# Altium project SVPXGR740_3U.PrjPcb (part 5 of 8)

## Sheet Flash.SchDoc
size A4
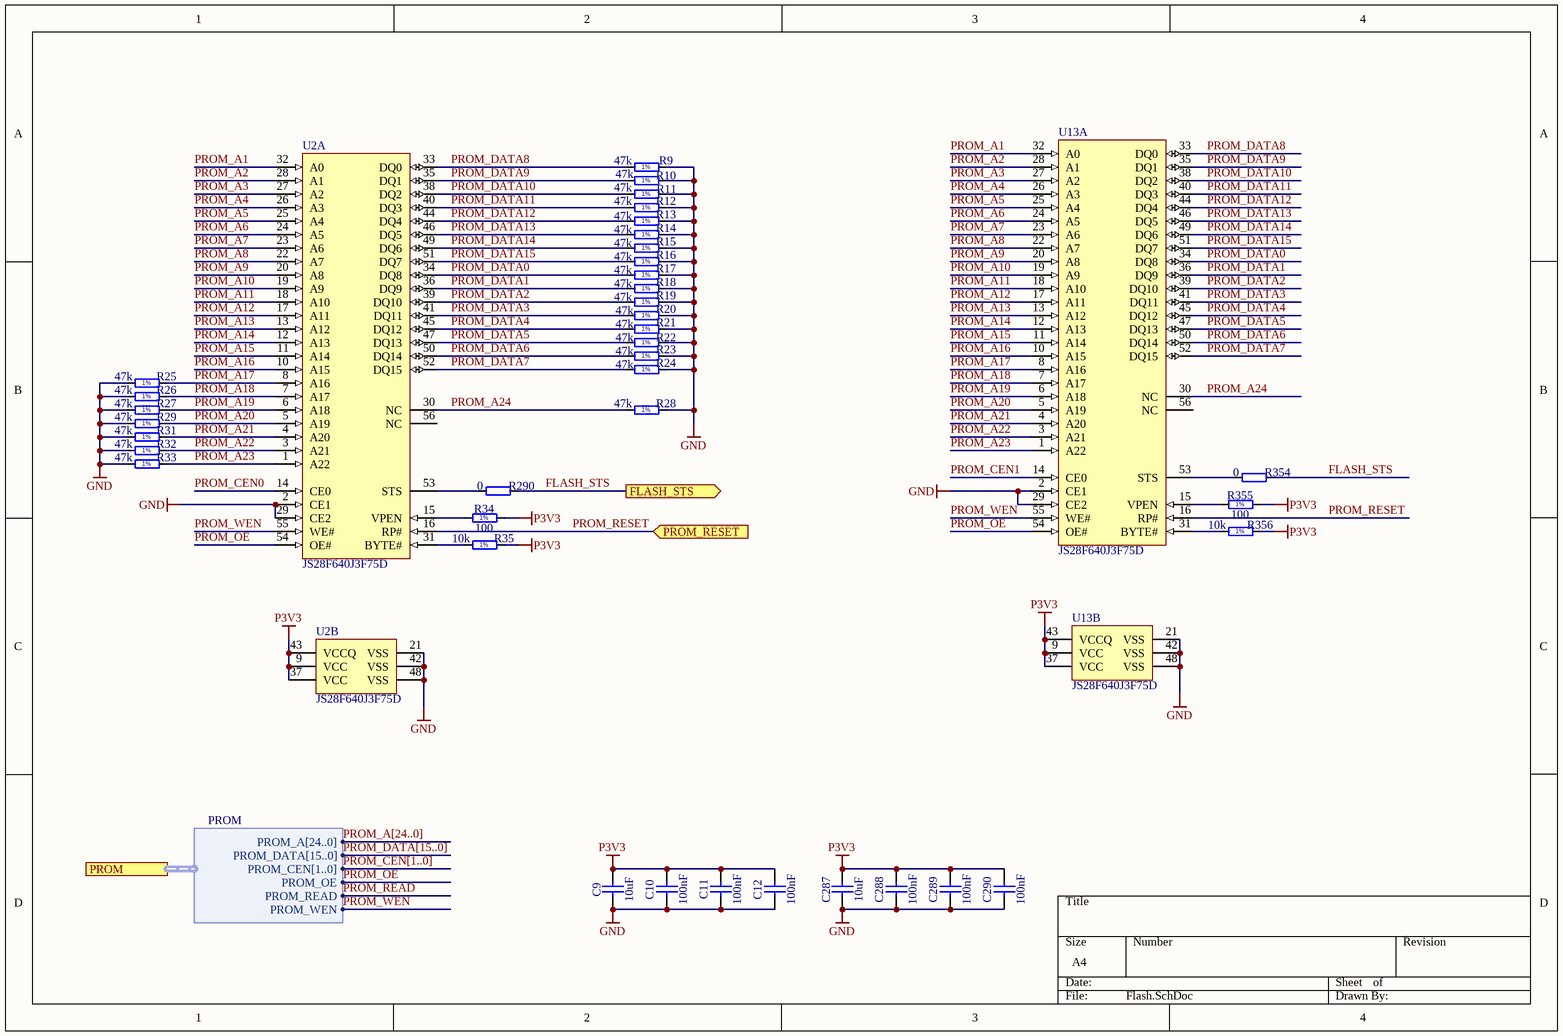
[diagram p13: Flash.SchDoc]

### Parts
C9  10uF  [CAPC2012X135N]
C10  100nF  [CAPC0603X33N]
C11  100nF  [CAPC0603X33N]
C12  100nF  [CAPC0603X33N]
C287  10uF  [CAPC2012X135N]
C288  100nF  [CAPC0603X33N]
C289  100nF  [CAPC0603X33N]
C290  100nF  [CAPC0603X33N]
R9  47k  [RESC1005X40N]
R10  47k  [RESC1005X40N]
R11  47k  [RESC1005X40N]
R12  47k  [RESC1005X40N]
R13  47k  [RESC1005X40N]
R14  47k  [RESC1005X40N]
R15  47k  [RESC1005X40N]
R16  47k  [RESC1005X40N]
R17  47k  [RESC1005X40N]
R18  47k  [RESC1005X40N]
R19  47k  [RESC1005X40N]
R20  47k  [RESC1005X40N]
R21  47k  [RESC1005X40N]
R22  47k  [RESC1005X40N]
R23  47k  [RESC1005X40N]
R24  47k  [RESC1005X40N]
R25  47k  [RESC1005X40N]
R26  47k  [RESC1005X40N]
R27  47k  [RESC1005X40N]
R28  47k  [RESC1005X40N]
R29  47k  [RESC1005X40N]
R31  47k  [RESC1005X40N]
R32  47k  [RESC1005X40N]
R33  47k  [RESC1005X40N]
R34  100  [RESC1005X40N]
R35  10k  [RESC1005X40N]
R290  0  [RESC0603X28N]
R354  0  [RESC0603X28N]
R355  100  [RESC1005X40N]
R356  10k  [RESC1005X40N]
U2  JS28F640J3F75D  [MICT-JS-56_N]  (parts A,B of 2)
U13  JS28F640J3F75D  [MICT-JS-56_N]  (parts A,B of 2)

### Ports
FLASH_STS (out), PROM (harness PROM), PROM_RESET (in)

### Harnesses
PROM: PROM_A[24..0], PROM_DATA[15..0], PROM_CEN[1..0], PROM_OE, PROM_READ, PROM_WEN

### Nets
GND: C9.1 C10.2 C11.2 C12.2 C287.1 C288.2 C289.2 C290.2 R9.2 R10.2 R11.2 R12.2 R13.2 R14.2 R15.2 R16.2 R17.2 R18.2 R19.2 R20.2 R21.2 R22.2 R23.2 R24.2 R25.1 R26.1 R27.1 R28.2 R29.1 R31.1 R32.1 R33.1 U2.2(CE1) U2.21(VSS) U2.29(CE2) U2.42(VSS) U2.48(VSS) U13.2(CE1) U13.21(VSS) U13.29(CE2) U13.42(VSS) U13.48(VSS)
P3V3: C9.2 C10.1 C11.1 C12.1 C287.2 C288.1 C289.1 C290.1 R34.2 R35.2 R355.2 R356.2 U2.9(VCC) U2.37(VCC) U2.43(VCCQ) U13.9(VCC) U13.37(VCC) U13.43(VCCQ)  [project net 3.3V]
FLASH_STS: R290.2 R354.2 ; port FLASH_STS
PROM_A1: U2.32(A0) U13.32(A0)
PROM_A2: U2.28(A1) U13.28(A1)
PROM_A3: U2.27(A2) U13.27(A2)
PROM_A4: U2.26(A3) U13.26(A3)
PROM_A5: U2.25(A4) U13.25(A4)
PROM_A6: U2.24(A5) U13.24(A5)
PROM_A7: U2.23(A6) U13.23(A6)
PROM_A8: U2.22(A7) U13.22(A7)
PROM_A9: U2.20(A8) U13.20(A8)
PROM_A10: U2.19(A9) U13.19(A9)
PROM_A11: U2.18(A10) U13.18(A10)
PROM_A12: U2.17(A11) U13.17(A11)
PROM_A13: U2.13(A12) U13.13(A12)
PROM_A14: U2.12(A13) U13.12(A13)
PROM_A15: U2.11(A14) U13.11(A14)
PROM_A16: U2.10(A15) U13.10(A15)
PROM_A17: R25.2 U2.8(A16) U13.8(A16)
PROM_A18: R26.2 U2.7(A17) U13.7(A17)
PROM_A19: R27.2 U2.6(A18) U13.6(A18)
PROM_A20: R29.2 U2.5(A19) U13.5(A19)
PROM_A21: R31.2 U2.4(A20) U13.4(A20)
PROM_A22: R32.2 U2.3(A21) U13.3(A21)
PROM_A23: R33.2 U2.1(A22) U13.1(A22)
PROM_A24: R28.1 U2.30(NC) U13.30(NC)
PROM_CEN0: U2.14(CE0)
PROM_CEN1: U13.14(CE0)
PROM_DATA0: R17.1 U2.34(DQ8) U13.34(DQ8)
PROM_DATA1: R18.1 U2.36(DQ9) U13.36(DQ9)
PROM_DATA2: R19.1 U2.39(DQ10) U13.39(DQ10)
PROM_DATA3: R20.1 U2.41(DQ11) U13.41(DQ11)
PROM_DATA4: R21.1 U2.45(DQ12) U13.45(DQ12)
PROM_DATA5: R22.1 U2.47(DQ13) U13.47(DQ13)
PROM_DATA6: R23.1 U2.50(DQ14) U13.50(DQ14)
PROM_DATA7: R24.1 U2.52(DQ15) U13.52(DQ15)
PROM_DATA8: R9.1 U2.33(DQ0) U13.33(DQ0)
PROM_DATA9: R10.1 U2.35(DQ1) U13.35(DQ1)
PROM_DATA10: R11.1 U2.38(DQ2) U13.38(DQ2)
PROM_DATA11: R12.1 U2.40(DQ3) U13.40(DQ3)
PROM_DATA12: R13.1 U2.44(DQ4) U13.44(DQ4)
PROM_DATA13: R14.1 U2.46(DQ5) U13.46(DQ5)
PROM_DATA14: R15.1 U2.49(DQ6) U13.49(DQ6)
PROM_DATA15: R16.1 U2.51(DQ7) U13.51(DQ7)
PROM_OE: U2.54(OE#) U13.54(OE#) ; port PROM.PROM_OE
PROM_RESET: U2.16(RP#) U13.16(RP#) ; port PROM_RESET
PROM_WEN: U2.55(WE#) U13.55(WE#) ; port PROM.PROM_WEN
NetR34_1: R34.1 U2.15(VPEN)
NetR35_1: R35.1 U2.31(BYTE#)
NetR290_1: R290.1 U2.53(STS)
NetR354_1: R354.1 U13.53(STS)
NetR355_1: R355.1 U13.15(VPEN)
NetR356_1: R356.1 U13.31(BYTE#)

Not connected (* = marked no-connect by the designer): U2 56(NC); U13 56(NC)

### Buses and harness runs
bus PROM_A[24..0]
bus PROM_CEN[1..0]
bus PROM_DATA[15..0]

### Notes on the sheet
- (in symbol R0402_10K_1%_0.0625W_100PPM) 1%
- (in symbol R0402_47K_1%_0.0625W_100PPM) 1%
- (in symbol R0402_100R_1%_0.0625W_100PPM) 1%

### Library data of the parts
C9 C287 = CC0805_10UF_16V_10%_X5R: Non-polarised capacitor; Part Description: SMD Multilayer Chip Ceramic Capacitor; Manufacturer: GENERIC; Manufacturer1 Part Number: C0805C106K4PAC; Voltage: 16V; TC: X5R; Tolerance: ±10%; Part Number: CC0805_10UF_16V_10%_X5R; Component Kind: Standard; Component Type: Standard; Pin Count: 2; Value: 10uF; Status: Preferred; Manufacturer Part Number: CC0805_10UF_16V_10%_X5R; Case: 0805; Mounted: Yes; Socket: No; SMD: Yes; Sense: No; Manufacturer1 Example: KEMET; Manufacturer1 ComponentHeight: 1.4mm; HelpURL: \\cern.ch\dfs\Applications\Altium\Datasheets\CC1206_X5R_KEMET.pdf; Author: CERN DEM JLC; CreateDate: 03.12.2007; LatestRevisionDate: 03.12.2007
C10-C12 C288-C290 = CC0201_100NF_6.3V_10%_X5R: Non-polarised capacitor; Manufacturer: GENERIC; Part Description: SMD Multilayer Chip Ceramic Capacitor; Manufacturer1 Part Number: 02016D104KAT2A; Voltage: 6.3V; TC: X5R; Tolerance: ±10%; Part Number: CC0201_100NF_6.3V_10%_X5R; Component Kind: Standard; Component Type: Standard; Pin Count: 2; Value: 100nF; Status: Not Recommended; Manufacturer Part Number: CC0201_100NF_6.3V_10%_X5R; Case: 0201; Mounted: Yes; Socket: No; SMD: Yes; Sense: No; Manufacturer1 Example: AVX; Manufacturer1 ComponentHeight: 0.33mm; HelpURL: \\cern.ch\dfs\Applications\Altium\Datasheets\CC0201_X5R_AVX.pdf; Author: CERN DEM JLC; CreateDate: 03/12/2007; LatestRevisionDate: 03/12/2007
R9-R29 R31-R33 = R0402_47K_1%_0.0625W_100PPM: Resistor - 1%; Part Description: General Purpose Thick Film Chip Resistor; Manufacturer: GENERIC; Manufacturer1 Part Number: 232270675103L; TC: ±100ppm/°C; PressFit: No; Part Number: R0402_47K_1%_0.0625W_100PPM; Component Kind: Standard; Component Type: Standard; Pin Count: 2; Value: 47k; Status: Not Recommended; Power: 0.0625W; Tolerance: ±1%; Manufacturer Part Number: R0402_47K_1%_0.0625W_100PPM; Case: 0402; Mounted: Yes; Sense: No; Socket: No; SMD: Yes; Manufacturer1 Example: YAGEO PHYCOMP; Manufacturer1 ComponentHeight: 0.4mm; HelpURL: \\cern.ch\dfs\Applications\Altium\Datasheets\R0402_Phycomp_RC0402.pdf; Author: CERN DEM JLC; CreateDate: 03.12.2007; LatestRevisionDate: 17.10.2012
R34 R355 = R0402_100R_1%_0.0625W_100PPM: Resistor - 1%; Part Description: General Purpose Thick Film Chip Resistor; Manufacturer: GENERIC; Manufacturer1 Part Number: 232270671001L; TC: ±100ppm/°C; PressFit: No; Part Number: R0402_100R_1%_0.0625W_100PPM; Component Kind: Standard; Component Type: Standard; Pin Count: 2; Value: 100; Status: Not Recommended; Power: 0.0625W; Tolerance: ±1%; Manufacturer Part Number: R0402_100R_1%_0.0625W_100PPM; Case: 0402; Mounted: Yes; Sense: No; Socket: No; SMD: Yes; Manufacturer1 Example: YAGEO PHYCOMP; Manufacturer1 ComponentHeight: 0.4mm; HelpURL: \\cern.ch\dfs\Applications\Altium\Datasheets\R0402_Phycomp_RC0402.pdf; Author: CERN DEM JLC; CreateDate: 03.12.2007; LatestRevisionDate: 17.10.2012
R35 R356 = R0402_10K_1%_0.0625W_100PPM: Resistor - 1%; Manufacturer: GENERIC; Part Description: General Purpose Thick Film Chip Resistor; Manufacturer1 Part Number: 232270671003L; TC: ±100ppm/°C; PressFit: No; Manufacturer Part Number: R0402_10K_1%_0.0625W_100PPM; Part Number: R0402_10K_1%_0.0625W_100PPM; Tolerance: ±1%; Value: 10k; Component Kind: Standard; Component Type: Standard; Pin Count: 2; Status: Not Recommended; Power: 0.0625W; Case: 0402; Mounted: Yes; Sense: No; Socket: No; SMD: Yes; Manufacturer1 Example: YAGEO PHYCOMP; Manufacturer1 ComponentHeight: 0.4mm; HelpURL: \\cern.ch\dfs\Applications\Altium\Datasheets\R0402_Phycomp_RC0402.pdf; Author: CERN DEM JLC; CreateDate: 03/12/2007; LatestRevisionDate: 17/10/2012
R290 R354 = R0201_0R_JUMPER: Resistor; Part Description: 1A (0.05R Max DC Resistance) Zero Ohm Jumper; Manufacturer: GENERIC; Manufacturer1 Part Number: CRCW02010000Z0ED; PressFit: No; Part Number: R0201_0R_JUMPER; Component Kind: Standard; Component Type: Standard; Pin Count: 2; Value: 0; Status: Not Recommended; Manufacturer Part Number: R0201_0R_JUMPER; Case: 0201; Mounted: Yes; Sense: No; Socket: No; SMD: Yes; Manufacturer1 Example: VISHAY; Manufacturer1 ComponentHeight: 0.27mm; HelpURL: \\cern.ch\dfs\Applications\Altium\Datasheets\R0201_VISHAY_CRCW e3.pdf; Author: CERN DEM JLC; CreateDate: 19.11.2014; LatestRevisionDate: 08.01.2015
U2 U13 = CMP-0358-00064-1: 64 Mb (x8/x16) Parallel NOR Flash Memory, 75 ns, 2.7 to 3.6 V, 56-pin TSOP (JS), Tape & Reel; Part Family: J3Â; Manufacturer: Micron; Voltage: 2.7V-3.6VÂ; Speed: 75nsÂ; Density: 64MbÂ; Op Temp: -40C to +85CÂ; ComponentLink3Description: Package Specification; PackageVersion: Rev. 12; ComponentLink1URL: http://www.micron.com/; DatasheetVersion: Rev. 03; ComponentLink3URL: http://www.micron.com/~/media/Documents/Products/Data%20Sheet/NOR%20Flash/Parallel/P33/320003_P33_65nm_MLC_256MDiscrete_512MStack_DS.pdf; Width: x8/x16Â; RoHS: YesÂ; PackageDescription: 56-Pin TSOP, 18.4 X 14 mm, Pitch 0.5 mm; ComponentLink2Description: Datasheet; PartNumber: JS28F640J3F75D; PackageReference: MICT-JS-56Â; ComponentLink1Description: Manufacturer URL; ComponentLink2URL: http://www.micron.com/~/media/Documents/Products/Data%20Sheet/NOR%20Flash/Parallel/J3/208032_J3_65_SBC_DS.pdf; Mounting Technology: Surface Mount

## Sheet CON_MC_XMC_J11_64PIN.SchDoc
size A4
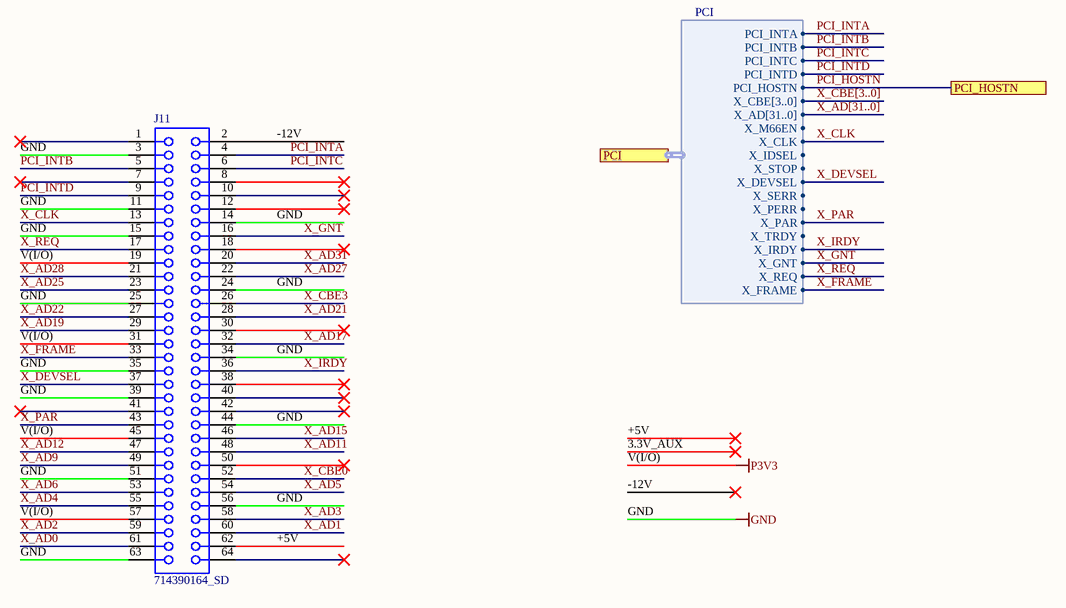
[diagram p14: CON_MC_XMC_J11_64PIN.SchDoc]

### Parts
J11  714390164_SD  [BTB1-2V64F]

### Ports
PCI (harness PCI), PCI_HOSTN

### Harnesses
PCI: PCI_INTA, PCI_INTB, PCI_INTC, PCI_INTD, PCI_HOSTN, X_CBE[3..0], X_AD[31..0], X_M66EN, X_CLK, X_IDSEL, X_STOP, X_DEVSEL, X_SERR, X_PERR, X_PAR, X_TRDY, X_IRDY, X_GNT, X_REQ, X_FRAME

### Nets
GND: J11.3 J11.11 J11.14 J11.15 J11.24 J11.25 J11.34 J11.35 J11.39 J11.44 J11.51 J11.56 J11.63
P3V3: J11.19 J11.31 J11.45 J11.57  [also labelled V(I/O)]  [project net 3.3V]
+5V: J11.62
-12V: J11.2
PCI_HOSTN: port PCI_HOSTN, port PCI.PCI_HOSTN
PCI_INTA: J11.4 ; port PCI.PCI_INTA
PCI_INTB: J11.5 ; port PCI.PCI_INTB
PCI_INTC: J11.6 ; port PCI.PCI_INTC
PCI_INTD: J11.9 ; port PCI.PCI_INTD
X_AD0: J11.61
X_AD1: J11.60
X_AD2: J11.59
X_AD3: J11.58
X_AD4: J11.55
X_AD5: J11.54
X_AD6: J11.53
X_AD9: J11.49
X_AD11: J11.48
X_AD12: J11.47
X_AD15: J11.46
X_AD17: J11.32
X_AD19: J11.29
X_AD21: J11.28
X_AD22: J11.27
X_AD25: J11.23
X_AD27: J11.22
X_AD28: J11.21
X_AD31: J11.20
X_CBE0: J11.52
X_CBE3: J11.26
X_CLK: J11.13 ; port PCI.X_CLK
X_DEVSEL: J11.37 ; port PCI.X_DEVSEL
X_FRAME: J11.33 ; port PCI.X_FRAME
X_GNT: J11.16 ; port PCI.X_GNT
X_IRDY: J11.36 ; port PCI.X_IRDY
X_PAR: J11.43 ; port PCI.X_PAR
X_REQ: J11.17 ; port PCI.X_REQ

Not connected (* = marked no-connect by the designer): J11 1* 7* 8* 10* 12* 18* 30* 38* 40* 41* 42* 50* 64*

### Buses and harness runs
bus X_AD[31..0]
bus X_CBE[3..0]

### Library data of the parts
J11 = CMP-0001-00081-1: Board-to-Board Connector, Vertical, 2-Row, Pitch 1mm, 64-Position, Female; Mating Connector: Molex-714360164; ClassName: Board Template Connector; Datasheet Version: Apr-2006; Package Reference: BTB1-2V64F; Publisher: Altium; Component Kind: Standard

## Sheet CON_MC_XMC_J12_64PIN.SchDoc
size A4
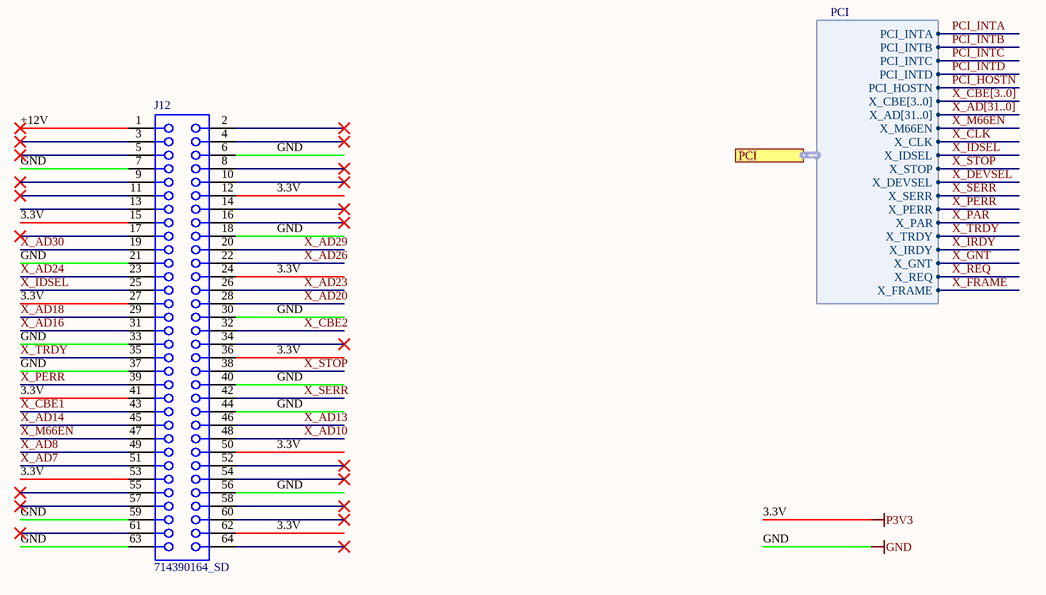
[diagram p15: CON_MC_XMC_J12_64PIN.SchDoc]

### Parts
J12  714390164_SD  [BTB1-2V64F]

### Ports
PCI (harness PCI)

### Harnesses
PCI: PCI_INTA, PCI_INTB, PCI_INTC, PCI_INTD, PCI_HOSTN, X_CBE[3..0], X_AD[31..0], X_M66EN, X_CLK, X_IDSEL, X_STOP, X_DEVSEL, X_SERR, X_PERR, X_PAR, X_TRDY, X_IRDY, X_GNT, X_REQ, X_FRAME

### Nets
3.3V: J12.12 J12.15 J12.24 J12.27 J12.36 J12.41 J12.50 J12.53 J12.62  [also labelled P3V3]
GND: J12.6 J12.7 J12.18 J12.21 J12.30 J12.33 J12.37 J12.40 J12.44 J12.56 J12.59 J12.63
+12V: J12.1
X_AD7: J12.51
X_AD8: J12.49
X_AD10: J12.48
X_AD13: J12.46
X_AD14: J12.45
X_AD16: J12.31
X_AD18: J12.29
X_AD20: J12.28
X_AD23: J12.26
X_AD24: J12.23
X_AD26: J12.22
X_AD29: J12.20
X_AD30: J12.19
X_CBE1: J12.43
X_CBE2: J12.32
X_IDSEL: J12.25 ; port PCI.X_IDSEL
X_M66EN: J12.47 ; port PCI.X_M66EN
X_PERR: J12.39 ; port PCI.X_PERR
X_SERR: J12.42 ; port PCI.X_SERR
X_STOP: J12.38 ; port PCI.X_STOP
X_TRDY: J12.35 ; port PCI.X_TRDY

Not connected (* = marked no-connect by the designer): J12 2* 3* 4* 5* 8* 9* 10* 11* 13 14* 16* 17* 34* 52* 54* 55* 57* 58* 60* 61* 64*

### Buses and harness runs
bus X_AD[31..0]
bus X_CBE[3..0]

### Library data of the parts
J12 = CMP-0001-00081-1: as J11 on sheet CON_MC_XMC_J11_64PIN; ClassName: Board Template Connector; Datasheet Version: Apr-2006; Package Reference: BTB1-2V64F; Publisher: Altium; Component Kind: Standard

## Sheet CON_MC_XMC_J13_64PIN.SchDoc
size A4
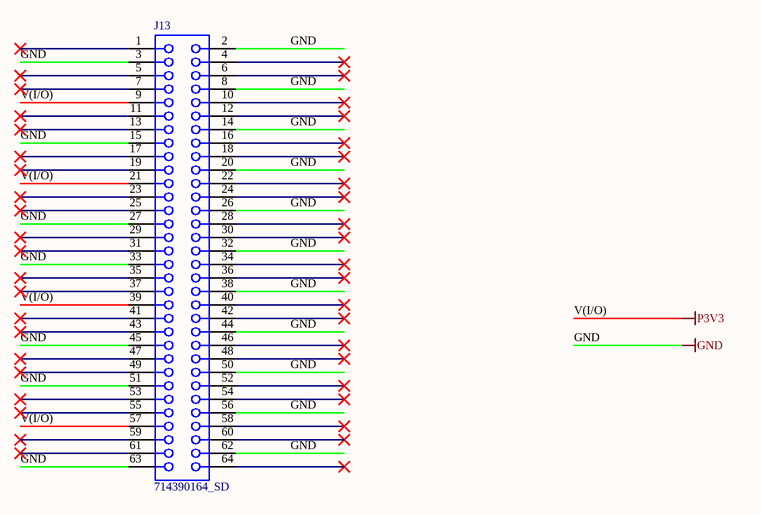
[diagram p16: CON_MC_XMC_J13_64PIN.SchDoc]

### Parts
J13  714390164_SD  [BTB1-2V64F]

### Nets
GND: J13.2 J13.3 J13.8 J13.14 J13.15 J13.20 J13.26 J13.27 J13.32 J13.33 J13.38 J13.44 J13.45 J13.50 J13.51 J13.56 J13.62 J13.63
P3V3: J13.9 J13.21 J13.39 J13.57  [also labelled V(I/O)]  [project net 3.3V]

Not connected (* = marked no-connect by the designer): J13 1* 4* 5* 6* 7* 10* 11* 12* 13* 16* 17* 18* 19* 22* 23* 24* 25* 28* 29* 30* 31* 34* 35* 36* 37* 40* 41* 42* 43* 46* 47* 48* 49* 52* 53* 54* 55* 58* 59* 60* 61* 64*

### Library data of the parts
J13 = CMP-0001-00081-1: as J11 on sheet CON_MC_XMC_J11_64PIN; ClassName: Board Template Connector; Datasheet Version: Apr-2006; Package Reference: BTB1-2V64F; Publisher: Altium; Component Kind: Standard

## Sheet CON_MC_XMC_J14_64PIN.SchDoc
size A4
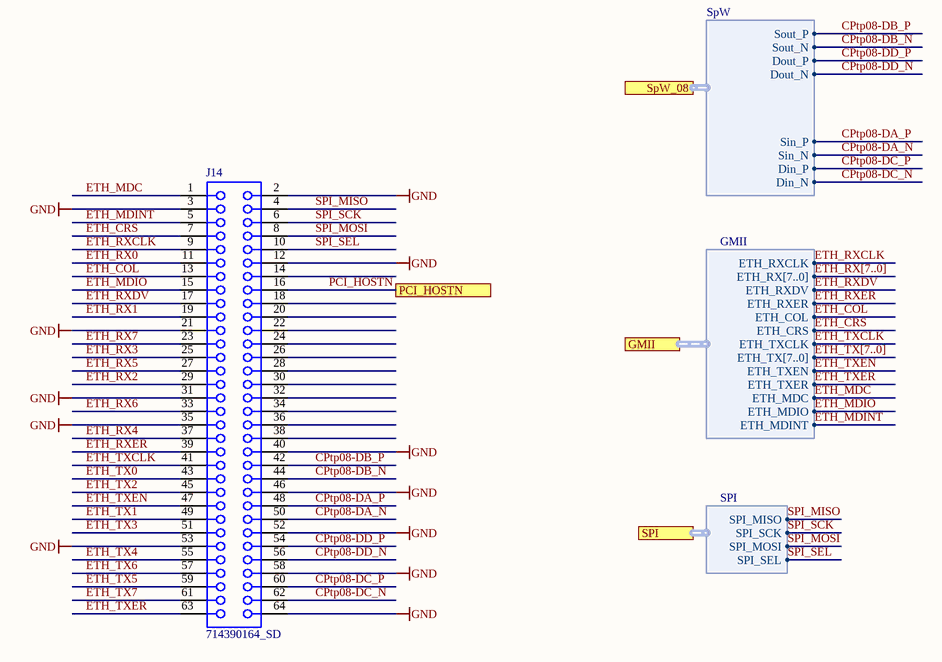
[diagram p17: CON_MC_XMC_J14_64PIN.SchDoc]

### Parts
J14  714390164_SD  [BTB1-2V64F]

### Ports
GMII (harness GMII), PCI_HOSTN, SPI (harness SPI), SpW_08 (harness SpW)

### Harnesses
GMII: ETH_RXCLK, ETH_RX[7..0], ETH_RXDV, ETH_RXER, ETH_COL, ETH_CRS, ETH_TXCLK, ETH_TX[7..0], ETH_TXEN, ETH_TXER, ETH_MDC, ETH_MDIO, ETH_MDINT
SPI: SPI_MISO, SPI_SCK, SPI_MOSI, SPI_SEL
SpW: Sout_P, Sout_N, Dout_P, Dout_N, Sin_P, Sin_N, Din_P, Din_N

### Nets
GND: J14.2 J14.3 J14.12 J14.21 J14.31 J14.35 J14.40 J14.46 J14.52 J14.53 J14.58 J14.64
CPtp08-DA_N: J14.50 ; port SpW_08.Sin_N
CPtp08-DA_P: J14.48 ; port SpW_08.Sin_P
CPtp08-DB_N: J14.44 ; port SpW_08.Sout_N
CPtp08-DB_P: J14.42 ; port SpW_08.Sout_P
CPtp08-DC_N: J14.62 ; port SpW_08.Din_N
CPtp08-DC_P: J14.60 ; port SpW_08.Din_P
CPtp08-DD_N: J14.56 ; port SpW_08.Dout_N
CPtp08-DD_P: J14.54 ; port SpW_08.Dout_P
ETH_COL: J14.13 ; port GMII.ETH_COL
ETH_CRS: J14.7 ; port GMII.ETH_CRS
ETH_MDC: J14.1 ; port GMII.ETH_MDC
ETH_MDINT: J14.5 ; port GMII.ETH_MDINT
ETH_MDIO: J14.15 ; port GMII.ETH_MDIO
ETH_RX0: J14.11
ETH_RX1: J14.19
ETH_RX2: J14.29
ETH_RX3: J14.25
ETH_RX4: J14.37
ETH_RX5: J14.27
ETH_RX6: J14.33
ETH_RX7: J14.23
ETH_RXCLK: J14.9 ; port GMII.ETH_RXCLK
ETH_RXDV: J14.17 ; port GMII.ETH_RXDV
ETH_RXER: J14.39 ; port GMII.ETH_RXER
ETH_TX0: J14.43
ETH_TX1: J14.49
ETH_TX2: J14.45
ETH_TX3: J14.51
ETH_TX4: J14.55
ETH_TX5: J14.59
ETH_TX6: J14.57
ETH_TX7: J14.61
ETH_TXCLK: J14.41 ; port GMII.ETH_TXCLK
ETH_TXEN: J14.47 ; port GMII.ETH_TXEN
ETH_TXER: J14.63 ; port GMII.ETH_TXER
PCI_HOSTN: J14.16 ; port PCI_HOSTN
SPI_MISO: J14.4 ; port SPI.SPI_MISO
SPI_MOSI: J14.8 ; port SPI.SPI_MOSI
SPI_SCK: J14.6 ; port SPI.SPI_SCK
SPI_SEL: J14.10 ; port SPI.SPI_SEL

Not connected (* = marked no-connect by the designer): J14 14 18 20 22 24 26 28 30 32 34 36 38

### Buses and harness runs
bus ETH_RX[7..0]
bus ETH_TX[7..0]

### Library data of the parts
J14 = CMP-0001-00081-1: as J11 on sheet CON_MC_XMC_J11_64PIN; ClassName: Board Template Connector; Datasheet Version: Apr-2006; Package Reference: BTB1-2V64F; Publisher: Altium; Component Kind: Standard

## Sheet Power.SchDoc
size A2
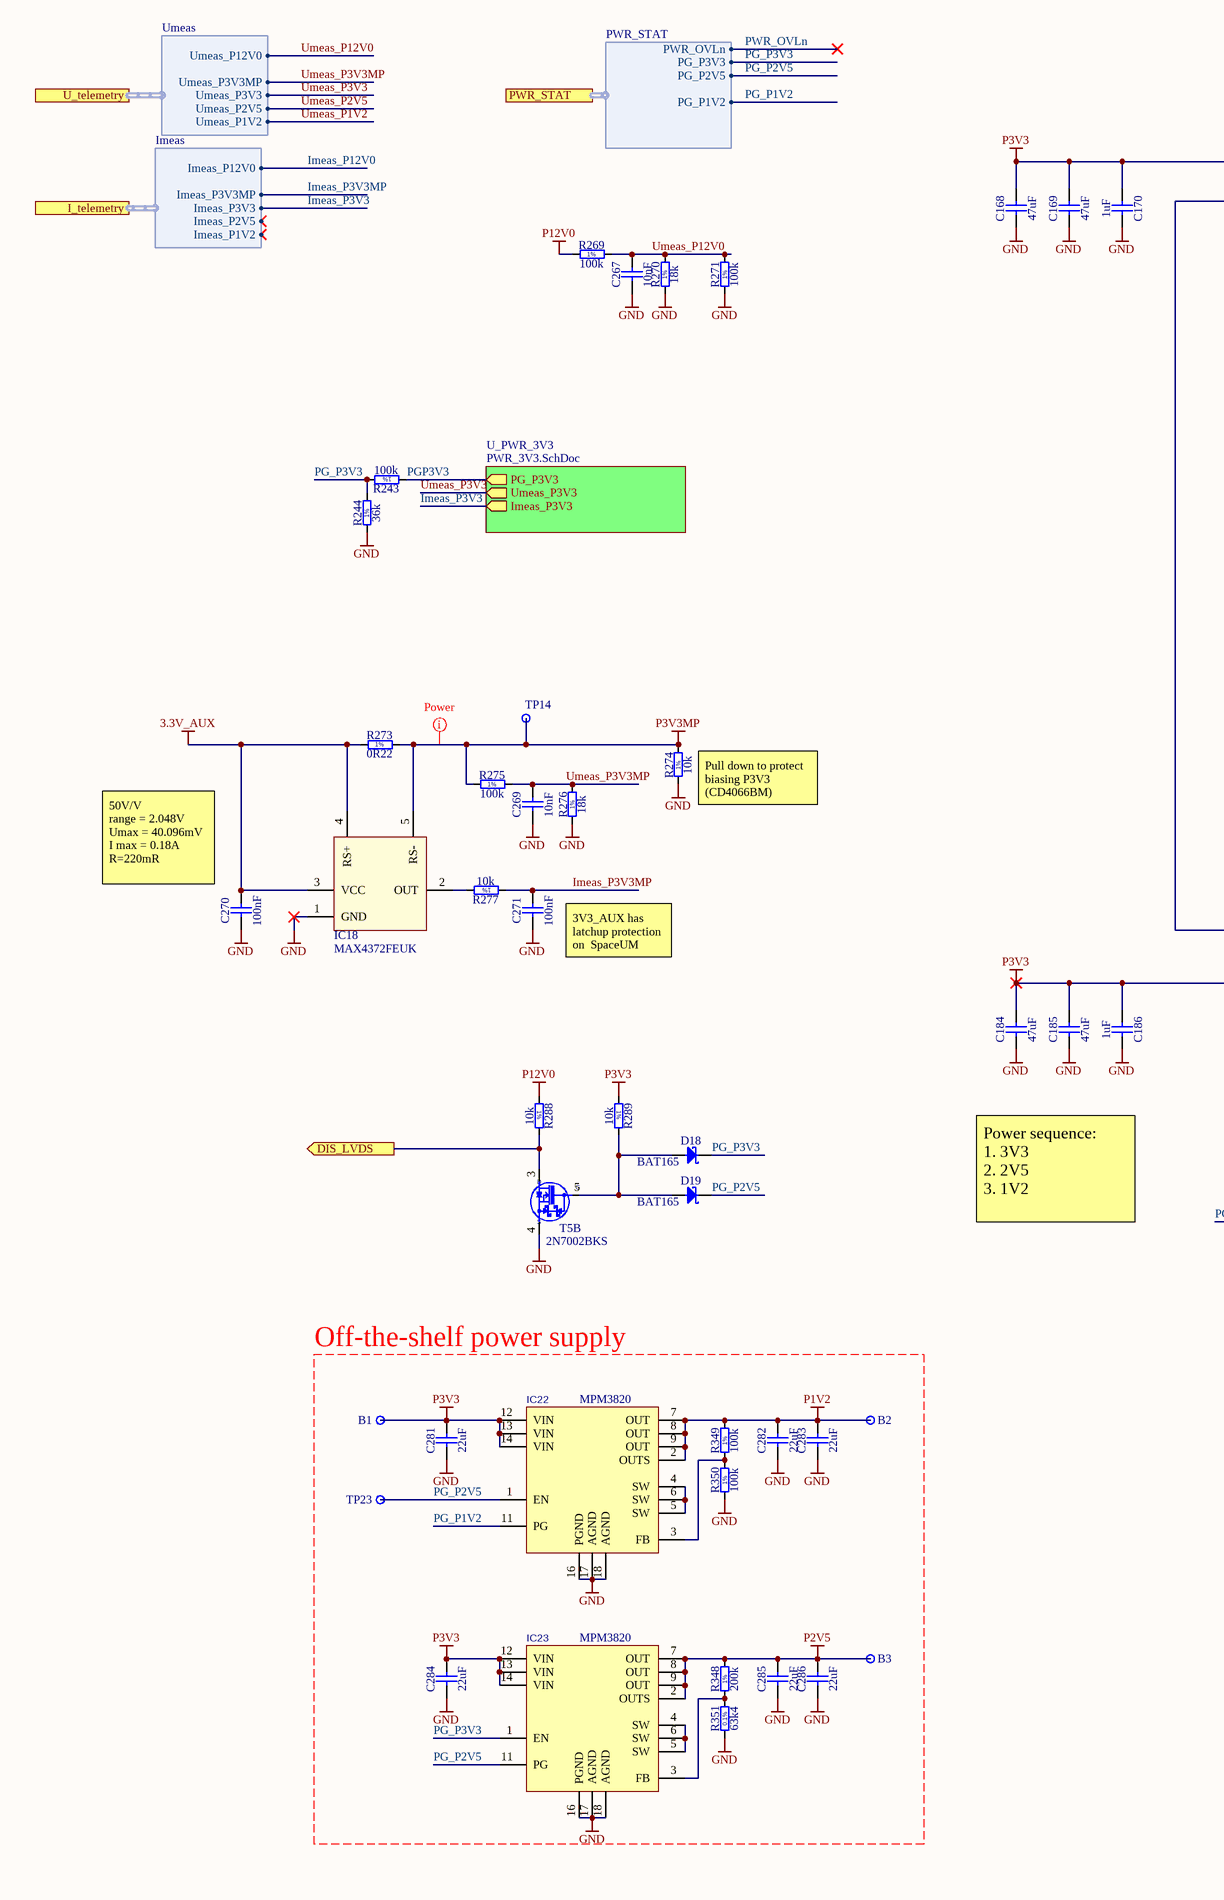
[diagram p18: Power.SchDoc, left]
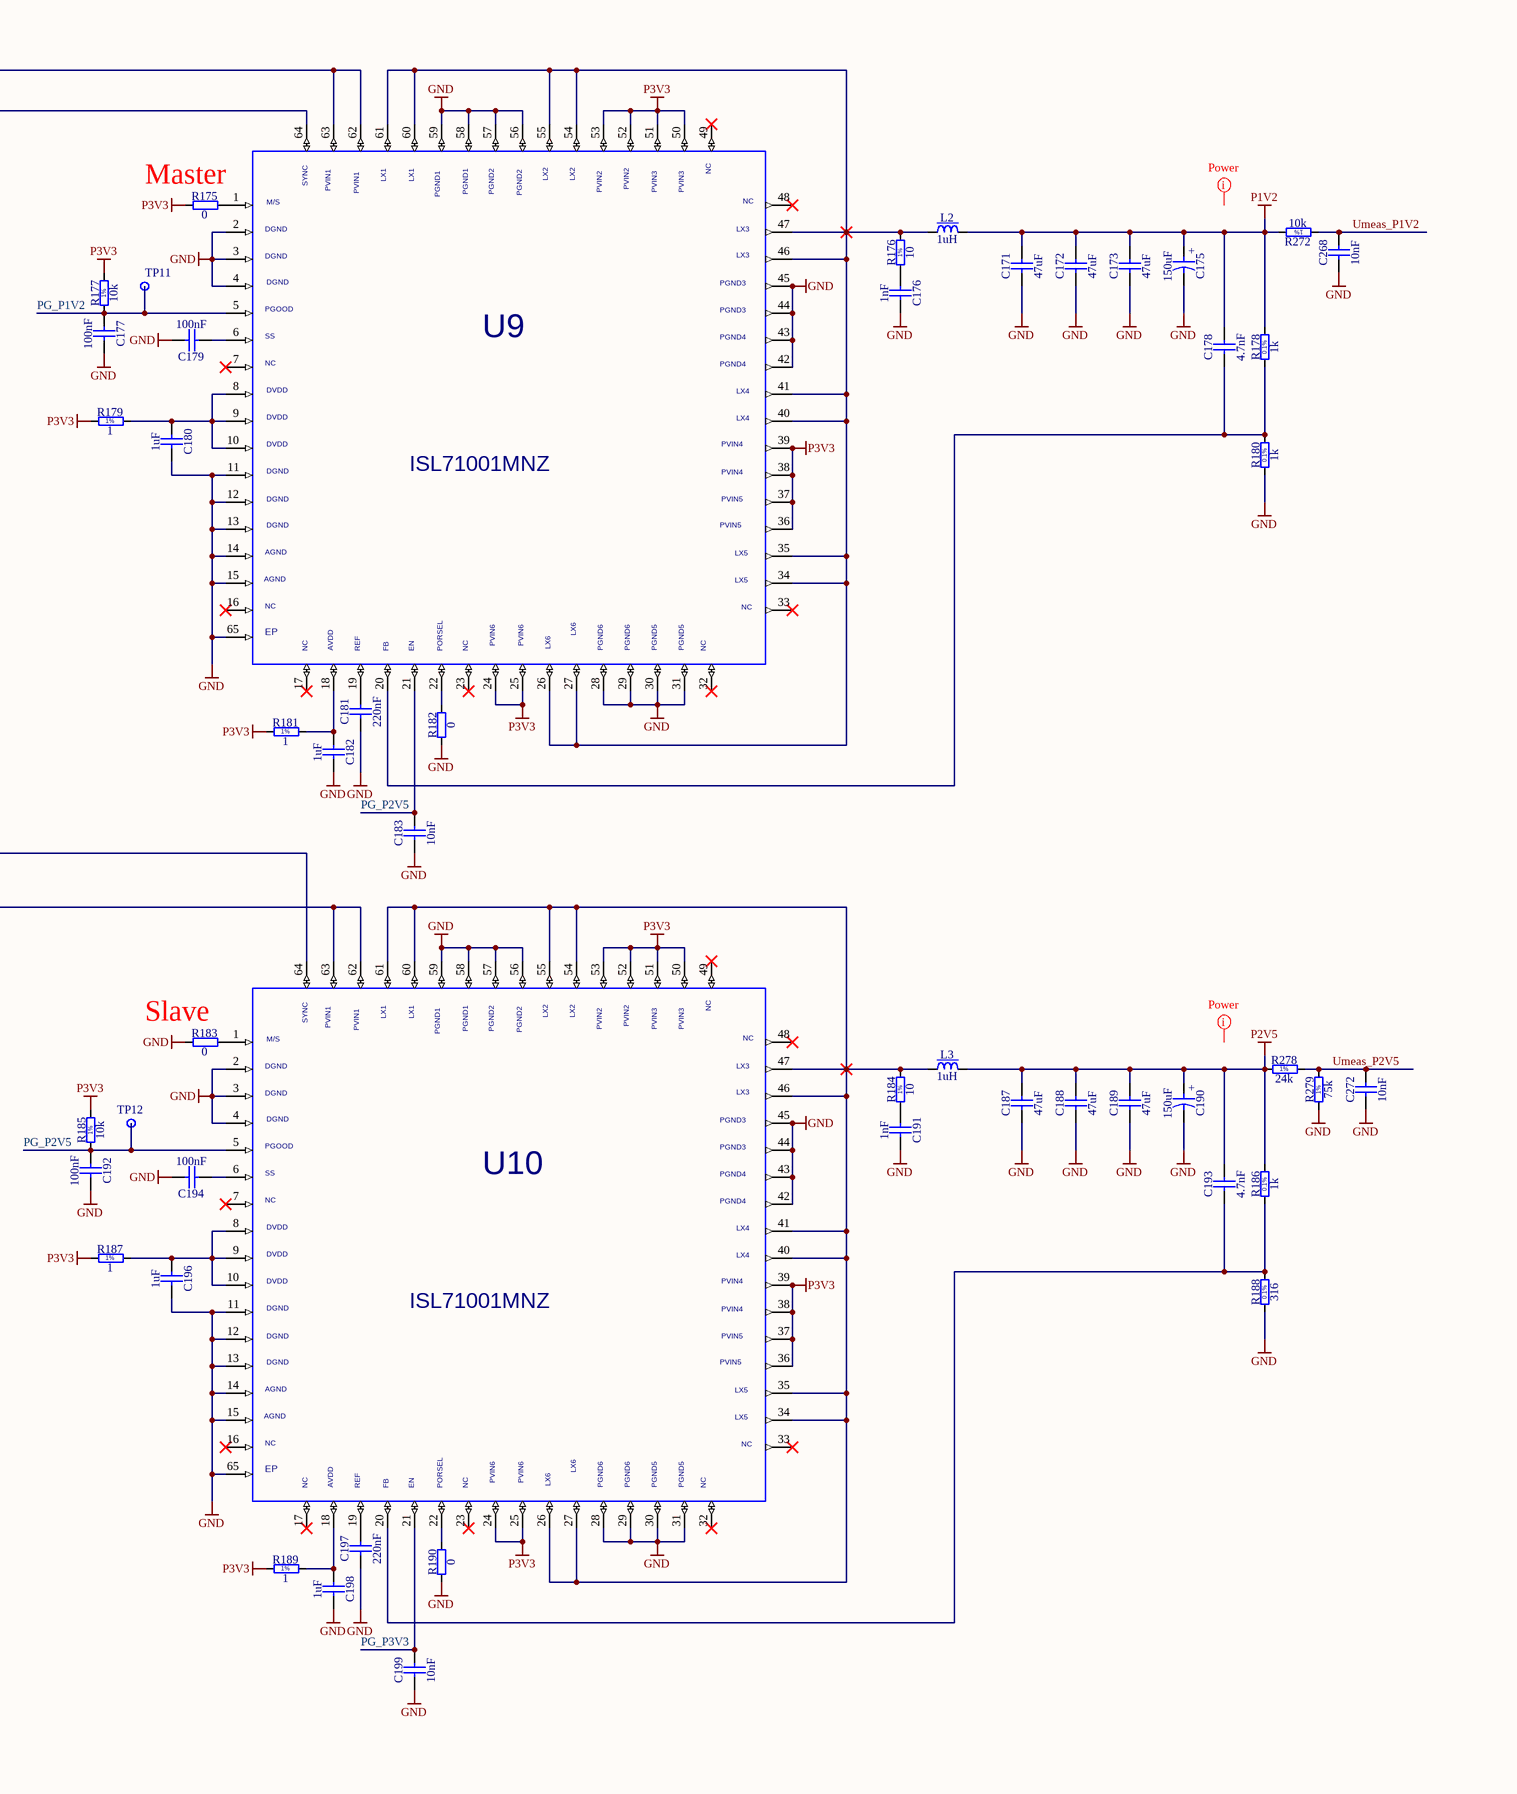
[diagram p19: Power.SchDoc, right]

### Parts
(Parts that share a designator on the sheet are numbered #1, #2 ... from top to bottom, then left to right.)
B1  Plated Hole  [c150h100]  (value not drawn)  (no BOM)
B2  Plated Hole  [c150h100]  (value not drawn)  (no BOM)
B3  Plated Hole  [c150h100]  (value not drawn)  (no BOM)
C168  47uF  [CAPC3216X180N]
C169  47uF  [CAPC3216X180N]
C170  1uF  [CAPC1005X55N]
C171  47uF  [CAPC3216X180N]
C172  47uF  [CAPC3216X180N]
C173  47uF  [CAPC3216X180N]
C175  150uF  [CAPMP6032X280N]
C176  1nF  [CAPC1608X90N]
C177  100nF  [CAPC1005X55N]
C178  4.7nF  [CAPC1005X55N]
C179  100nF  [CAPC1005X55N]
C180  1uF  [CAPC1005X55N]
C181  220nF  [CAPC1005X55N]
C182  1uF  [CAPC1005X55N]
C183  10nF  [CAPC1005X55N]
C184  47uF  [CAPC3216X180N]
C185  47uF  [CAPC3216X180N]
C186  1uF  [CAPC1005X55N]
C187  47uF  [CAPC3216X180N]
C188  47uF  [CAPC3216X180N]
C189  47uF  [CAPC3216X180N]
C190  150uF  [CAPMP6032X280N]
C191  1nF  [CAPC1608X90N]
C192  100nF  [CAPC1005X55N]
C193  4.7nF  [CAPC1005X55N]
C194  100nF  [CAPC1005X55N]
C196  1uF  [CAPC1005X55N]
C197  220nF  [CAPC1005X55N]
C198  1uF  [CAPC1005X55N]
C199  10nF  [CAPC1005X55N]
C267  10nF  [CAPC1005X55N]
C268  10nF  [CAPC1005X55N]
C269  10nF  [CAPC1005X55N]
C270  100nF  [CAPC1005X55N]
C271  100nF  [CAPC1005X55N]
C272  10nF  [CAPC1005X55N]
C281  22uF  [CAPC2012X135N]
C282  22uF  [CAPC2012X135N]
C283  22uF  [CAPC2012X135N]
C284  22uF  [CAPC2012X135N]
C285  22uF  [CAPC2012X135N]
C286  22uF  [CAPC2012X135N]
D18  BAT165  [SOD2512X110N]
D19  BAT165  [SOD2512X110N]
IC18  MAX4372FEUK  [SOT95P270X145-5N]
IC22  MPM3820  [MPM3830]
IC23#1  MPM3820  [MPM3830]
L2  1uH  [INDM5552X300N]
L3  1uH  [INDM5552X300N]
R175  0  [RESC1005X40N]
R176  10  [RESC2012X60N]
R177  10k  [RESC1005X40N]
R178  1k  [RESC1608X55N]
R179  1  [RESC1608X55N]
R180  1k  [RESC1608X55N]
R181  1  [RESC1608X55N]
R182  0  [RESC1005X40N]
R183  0  [RESC1005X40N]
R184  10  [RESC2012X60N]
R185  10k  [RESC1005X40N]
R186  1k  [RESC1608X55N]
R187  1  [RESC1608X55N]
R188  316  [RESC1608X55N]
R189  1  [RESC1608X55N]
R190  0  [RESC1005X40N]
R243  100k  [RESC1005X40N]
R244  36k  [RESC1005X40N]
R269  100k  [RESC1005X40N]
R270  18k  [RESC1005X40N]
R271  100k  [RESC1005X40N]
R272  10k  [RESC1005X40N]
R273  0R22  [RESC3216X70N]
R274  10k  [RESC1005X40N]
R275  100k  [RESC1005X40N]
R276  18k  [RESC1005X40N]
R277  10k  [RESC1005X40N]
R278  24k  [RESC1005X40N]
R279  75k  [RESC1005X40N]
R288  10k  [RESC1005X40N]
R289  10k  [RESC1005X40N]
R348  200k  [RESC1005X40N]
R349  100k  [RESC1005X40N]
R350  100k  [RESC1005X40N]
R351  63k4  [RESC1608X55N]
T5  2N7002BKS  [SOT65P210X110-6N]  (part B of 2)
TP11  Test Point  [TPS127]  (value not drawn)
TP12  Test Point  [TPS127]  (value not drawn)
TP14  Test Point  [TPS127]  (value not drawn)
TP23  Test Point  [TPS127]  (value not drawn)
U9  PART_NUMBER: ISL71001MNZ  [TQFP64_393X393_197_EPJ]  (hidden comment: ISL71001M)
U10  PART_NUMBER: ISL71001MNZ  [TQFP64_393X393_197_EPJ]  (hidden comment: ISL71001M)

### Sub-sheets
U_PWR_3V3 = PWR_3V3.SchDoc: PG_P3V3 (out), Umeas_P3V3 (out), Imeas_P3V3 (out)

### Ports
DIS_LVDS (out), I_telemetry (harness Imeas), PWR_STAT (harness PWR_STAT), U_telemetry (harness Umeas)

### Harnesses
PWR_STAT: PG_P1V2, PG_P2V5, PG_P3V3, PWR_OVLn
Imeas: Imeas_P12V0, Imeas_P3V3, Imeas_P2V5, Imeas_P1V2, Imeas_P3V3MP
Umeas: Umeas_P12V0, Umeas_P3V3, Umeas_P2V5, Umeas_P1V2, Umeas_P3V3MP

### Nets
3.3V_AUX: C270.2 IC18.3(VCC) IC18.4(RS+) R273.1
GND: C168.1 C169.1 C170.2 C171.1 C172.1 C173.1 C175.2 C176.2 C177.2 C179.2 C180.2 C181.1 C182.2 C183.1 C184.1 C185.1 C186.2 C187.1 C188.1 C189.1 C190.2 C191.2 C192.2 C194.2 C196.2 C197.1 C198.2 C199.1 C267.1 C268.1 C269.1 C270.1 C271.1 C272.1 C281.1 C282.1 C283.1 C284.1 C285.1 C286.1 IC18.1(GND) IC22.16(PGND) IC22.17(AGND) IC22.18(AGND) IC23#1.16(PGND) IC23#1.17(AGND) IC23#1.18(AGND) R180.1 R182.1 R183.1 R188.1 R190.1 R244.1 R270.1 R271.1 R274.1 R276.1 R279.1 R350.1 R351.1 T5.4(S) U9.2 U9.3 U9.4 U9.11 U9.12 U9.13 U9.14 U9.15 U9.28 U9.29 U9.30 U9.31 U9.42 U9.43 U9.44 U9.45 U9.56 U9.57 U9.58 U9.59 U9.65 U10.2 U10.3 U10.4 U10.11 U10.12 U10.13 U10.14 U10.15 U10.28 U10.29 U10.30 U10.31 U10.42 U10.43 U10.44 U10.45 U10.56 U10.57 U10.58 U10.59 U10.65
P1V2: B2.1 C171.2 C172.2 C173.2 C175.1 C178.2 C282.2 C283.2 IC22.2(OUTS) IC22.7(OUT) IC22.8(OUT) IC22.9(OUT) L2.2 R178.2 R272.2 R349.2
P2V5: B3.1 C187.2 C188.2 C189.2 C190.1 C193.2 C285.2 C286.2 IC23#1.2(OUTS) IC23#1.7(OUT) IC23#1.8(OUT) IC23#1.9(OUT) L3.2 R186.2 R278.1 R348.2
P3V3: B1.1 C168.2 C169.2 C170.1 C184.2 C185.2 C186.1 C281.2 C284.2 IC22.12(VIN) IC22.13(VIN) IC22.14(VIN) IC23#1.12(VIN) IC23#1.13(VIN) IC23#1.14(VIN) R175.1 R177.2 R179.1 R181.1 R185.2 R187.1 R189.1 R289.1 U9.24 U9.25 U9.36 U9.37 U9.38 U9.39 U9.50 U9.51 U9.52 U9.53 U9.62 U9.63 U10.24 U10.25 U10.36 U10.37 U10.38 U10.39 U10.50 U10.51 U10.52 U10.53 U10.62 U10.63  [project net 3.3V]
P3V3MP: IC18.5(RS-) R273.2 R274.2 R275.1 TP14.1
P12V0: R269.1 R288.1  [project net VS1]
DIS_LVDS: R288.2 T5.3(D) ; port DIS_LVDS
Imeas_P3V3: sheet U_PWR_3V3/Imeas_P3V3, port I_telemetry.Imeas_P3V3
Imeas_P3V3MP: C271.2 R277.1 ; port I_telemetry.Imeas_P3V3MP
PG_P1V2: C177.1 IC22.11(PG) R177.1 TP11.1 U9.5 ; port PWR_STAT.PG_P1V2
PG_P2V5: C183.2 C192.1 D19.1(C) IC22.1(EN) IC23#1.11(PG) R185.1 TP12.1 TP23.1 U9.21 U10.5 ; port PWR_STAT.PG_P2V5
PG_P3V3: C199.2 D18.1(C) IC23#1.1(EN) R243.2 R244.2 U10.21 ; port PWR_STAT.PG_P3V3
PGP3V3: R243.1 ; sheet U_PWR_3V3/PG_P3V3
Umeas_P1V2: C268.2 R272.1 ; port U_telemetry.Umeas_P1V2
Umeas_P2V5: C272.2 R278.2 R279.2 ; port U_telemetry.Umeas_P2V5
Umeas_P3V3: sheet U_PWR_3V3/Umeas_P3V3, port U_telemetry.Umeas_P3V3
Umeas_P3V3MP: C269.2 R275.2 R276.2 ; port U_telemetry.Umeas_P3V3MP
Umeas_P12V0: C267.2 R269.2 R270.2 R271.2 ; port U_telemetry.Umeas_P12V0
NetC176_1: C176.1 R176.1
NetC178_1: C178.1 R178.1 R180.2 U9.20
NetC179_1: C179.1 U9.6
NetC180_1: C180.1 R179.2 U9.8 U9.9 U9.10
NetC181_2: C181.2 U9.19
NetC182_1: C182.1 R181.2 U9.18
NetC191_1: C191.1 R184.1
NetC193_1: C193.1 R186.1 R188.2 U10.20
NetC194_1: C194.1 U10.6
NetC196_1: C196.1 R187.2 U10.8 U10.9 U10.10
NetC197_2: C197.2 U10.19
NetC198_1: C198.1 R189.2 U10.18
NetD18_2: D18.2(A) D19.2(A) R289.2 T5.5(G)
NetIC18_2: IC18.2(OUT) R277.2
NetIC22_3: IC22.3(FB) R349.1 R350.2
NetIC22_4: IC22.4(SW) IC22.5(SW) IC22.6(SW)
NetIC23#1_3: IC23#1.3(FB) R348.1 R351.2
NetIC23#1_4: IC23#1.4(SW) IC23#1.5(SW) IC23#1.6(SW)
NetL2_1: L2.1 R176.2 U9.26 U9.27 U9.34 U9.35 U9.40 U9.41 U9.46 U9.47 U9.54 U9.55 U9.60 U9.61
NetL3_1: L3.1 R184.2 U10.26 U10.27 U10.34 U10.35 U10.40 U10.41 U10.46 U10.47 U10.54 U10.55 U10.60 U10.61
NetR175_2: R175.2 U9.1
NetR182_2: R182.2 U9.22
NetR183_2: R183.2 U10.1
NetR190_2: R190.2 U10.22
NetU9_64: U9.64 U10.64

Not connected (* = marked no-connect by the designer): U9 7* 16* 17* 23* 32* 33* 48* 49*; U10 7* 16* 17* 23* 32* 33* 48* 49*

### Layout directives
net class Power: (no net found under the mark), P3V3MP

### Notes on the sheet
- Master
- (near R274) Pull down to protect biasing P3V3 (CD4066BM)
- (near C270) 50V/V
  range = 2.048V
  Umax = 40.096mV
  I max = 0.18A
  R=220mR
- (near C271) 3V3_AUX has latchup protection on  SpaceUM
- (near R183) Slave
- Power sequence:
  1. 3V3
  2. 2V5
  3. 1V2
- Off-the-shelf power supply
- (in symbol CTE6032-28_150UF_10V_10%) +
- (in symbol ISL71001M) LX2; NC; SYNC; LX1; PVIN1; PVIN2; PVIN3; PGND1; PGND2; M/S; DGND; LX3; PGND3; PGOOD; SS; PGND4; DVDD; LX4; PVIN4; PVIN5; AGND; LX5; EP; LX6; PVIN6; AVDD; REF; FB; EN; PORSEL; PGND6; PGND5
- (in symbol R0402_10K_1%_0.0625W_100PPM) 1%
- (in symbol R0402_18K_1%_0.0625W_100PPM) 1%
- (in symbol R0402_24K_1%_0.0625W_100PPM) 1%
- (in symbol R0402_36K_1%_0.0625W_100PPM) 1%
- (in symbol R0402_75K_1%_0.0625W_100PPM) 1%
- (in symbol R0402_100K_1%_0.0625W_100PPM) 1%
- (in symbol R0402_200K_1%_0.0625W_100PPM) 1%
- (in symbol R0603_1K_0.1%_0.063W_10PPM) 0.1%
- (in symbol R0603_1R_1%_0.1W_200PPM) 1%
- (in symbol R0603_63K4_0.1%_0.063W_10PPM) 0.1%
- (in symbol R0603_316R_0.1%_0.063W_10PPM) 0.1%
- (in symbol R0805_10R_1%_0.125W_200PPM) 1%
- (in symbol R1206_0R22_1%_0.5W_100PPM) 1%

### Library data of the parts
B1-B3 = PLATED_HOLE1.0_PAD1.5: Single Terminal Socket; Part Description: Plated Through Hole: Hole Dia.=1mm Pad Dia.=1.5mm,  IPC-7251 Level C; Mounted: No; Part Number: PLATED_HOLE1.0_PAD1.5; Component Type: Standard (No BOM); Pin Count: 1; Family: Plated Hole; Socket: No; SMD: No; Sense: No; Status: None; ComponentHeight: 0mm; HelpURL: Undefined; Author: CERN DEM JLC; CreateDate: 30.10.2008; LatestRevisionDate: 30.10.2008; PackageDescription: Plated Through Hole: Hole Dia.=1mm Pad Dia.=1.5mm,  IPC-7251 Level C
C168 C169 C171-C173 C184 C185 C187-C189 = CC1206_47UF_10V_10%_X5R: Non-polarised capacitor; Part Description: SMD Multilayer Chip Ceramic Capacitor; Manufacturer: GENERIC; Manufacturer1 Part Number: GRM31CR61A476KE15; Voltage: 10V; TC: X5R; Tolerance: ±10%; Part Number: CC1206_47UF_10V_10%_X5R; Component Kind: Standard; Component Type: Standard; Pin Count: 2; Value: 47uF; Status: None; Manufacturer Part Number: CC1206_47UF_10V_10%_X5R; Case: 1206; Mounted: Yes; Socket: No; SMD: Yes; Sense: No; Manufacturer1 Example: MURATA; Manufacturer1 ComponentHeight: 1.8mm; HelpURL: \\cern.ch\dfs\Applications\Altium\Datasheets\CC1206_X5R_MURATA_GRM.pdf; Author: CERN DEM MR; CreateDate: 24.06.2016; LatestRevisionDate: 24.06.2016
C170 C180 C182 C186 C196 C198 = CC0402_1UF_16V_10%_X5R: Non-polarised capacitor; Part Description: SMD Multilayer Chip Ceramic Capacitor; Manufacturer: GENERIC; Manufacturer1 Part Number: C1005X5R1C105KT; Voltage: 16V; TC: X5R; Tolerance: ±10%; Part Number: CC0402_1UF_16V_10%_X5R; Component Kind: Standard; Component Type: Standard; Pin Count: 2; Value: 1uF; Status: Preferred; Manufacturer Part Number: CC0402_1UF_16V_10%_X5R; Case: 0402; Mounted: Yes; Socket: No; SMD: Yes; Sense: No; Manufacturer1 Example: TDK; Manufacturer1 ComponentHeight: 0.55mm; HelpURL: \\cern.ch\dfs\Applications\Altium\Datasheets\CC0402_X5R_TDK_C.pdf; Author: CERN DEM JLC; CreateDate: 25.10.2012; LatestRevisionDate: 25.10.2012
C175 C190 = CTE6032-28_150UF_10V_10%: Polarised capacitor; Part Description: Solid Tantalum Chip Capacitor; Manufacturer: GENERIC; Manufacturer1 Part Number: TAJC157K010R; Voltage: 10V; Tolerance: ±10%; Part Number: CTE6032-28_150UF_10V_10%; Component Kind: Standard; Component Type: Standard; Pin Count: 2; Value: 150uF; Status: Preferred; Manufacturer Part Number: CTE6032-28_150UF_10V_10%; Case: C; Mounted: Yes; Socket: No; SMD: Yes; Sense: No; Manufacturer1 Example: AVX; Manufacturer1 ComponentHeight: 2.8mm; HelpURL: \\cern.ch\dfs\Applications\Altium\Datasheets\CTE_AVX_TAJ.pdf; Author: CERN DEM JLC; CreateDate: 03.12.2007; LatestRevisionDate: 03.12.2007
C176 C191 = CC0603_1NF_50V_1%_NP0: Non-polarised capacitor; Part Description: SMD Multilayer Chip Ceramic Capacitor; Manufacturer: GENERIC; Manufacturer1 Part Number: 06035A102FAT2A; Voltage: 50V; TC: C0G/NP0; Tolerance: ±1%; Part Number: CC0603_1NF_50V_1%_NP0; Component Kind: Standard; Component Type: Standard; Pin Count: 2; Value: 1nF; Status: None; Manufacturer Part Number: CC0603_1NF_50V_1%_NP0; Case: 0603; Mounted: Yes; Socket: No; SMD: Yes; Sense: No; Manufacturer1 Example: AVX; Manufacturer1 ComponentHeight: 0.9mm; HelpURL: \\cern.ch\dfs\Applications\Altium\Datasheets\CC0603_C0G_AVX.pdf; Author: CERN DEM JLC; CreateDate: 15.06.2017; LatestRevisionDate: 15.06.2017
C177 C179 C192 C194 = CC0402_100NF_16V_10%_X5R: Non-polarised capacitor; Part Description: SMD Multilayer Chip Ceramic Capacitor; Manufacturer: GENERIC; Manufacturer1 Part Number: GRM155R61C104KA88D; Voltage: 16V; TC: X5R; Tolerance: ±10%; Part Number: CC0402_100NF_16V_10%_X5R; Component Kind: Standard; Component Type: Standard; Pin Count: 2; Value: 100nF; Status: None; Manufacturer Part Number: CC0402_100NF_16V_10%_X5R; Case: 0402; Mounted: Yes; Socket: No; SMD: Yes; Sense: No; Manufacturer1 Example: MURATA; Manufacturer1 ComponentHeight: 0.55mm; HelpURL: \\cern.ch\dfs\Applications\Altium\Datasheets\CC0402_X5R_MURATA_GRM.pdf; Author: CERN DEM JLC; CreateDate: 10.12.2013; LatestRevisionDate: 10.12.2013
C178 C193 = CC0402_4.7NF_16V_10%_X7R: Non-polarised capacitor; Part Description: SMD Multilayer Chip Ceramic Capacitor; Manufacturer: GENERIC; Manufacturer1 Part Number: 223878715632; Voltage: 16V; TC: X7R; Tolerance: ±10%; Part Number: CC0402_4.7NF_16V_10%_X7R; Component Kind: Standard; Component Type: Standard; Pin Count: 2; Value: 4.7nF; Status: Not Recommended; Manufacturer Part Number: CC0402_4.7NF_16V_10%_X7R; Case: 0402; Mounted: Yes; Socket: No; SMD: Yes; Sense: No; Manufacturer1 Example: PHYCOMP; Manufacturer1 ComponentHeight: 0.55mm; HelpURL: \\cern.ch\dfs\Applications\Altium\Datasheets\CC0402_X7R_PHYCOMP.pdf; Author: CERN DEM JLC; CreateDate: 03.12.2007; LatestRevisionDate: 03.12.2007
C181 C197 = CC0402_220NF_16V_10%_X7R: Non-polarised capacitor; Part Description: SMD Multilayer Chip Ceramic Capacitor; Manufacturer: GENERIC; Manufacturer1 Part Number: C1005X7R1C224KT; Voltage: 16V; TC: X7R; Tolerance: ±10%; Part Number: CC0402_220NF_16V_10%_X7R; Component Kind: Standard; Component Type: Standard; Pin Count: 2; Value: 220nF; Status: Preferred; Manufacturer Part Number: CC0402_220NF_16V_10%_X7R; Case: 0402; Mounted: Yes; Socket: No; SMD: Yes; Sense: No; Manufacturer1 Example: TDK; Manufacturer1 ComponentHeight: 0.55mm; HelpURL: \\cern.ch\dfs\Applications\Altium\Datasheets\CC0402_X7R_TDK_C.pdf; Author: CERN DEM JLC; CreateDate: 25.10.2012; LatestRevisionDate: 25.10.2012
C183 C199 = CC0402_10NF_16V_10%_X7R: Non-polarised capacitor; Part Description: SMD Multilayer Chip Ceramic Capacitor; Manufacturer: GENERIC; Manufacturer1 Part Number: 223878715636; Voltage: 16V; TC: X7R; Tolerance: ±10%; Part Number: CC0402_10NF_16V_10%_X7R; Component Kind: Standard; Component Type: Standard; Pin Count: 2; Value: 10nF; Status: Not Recommended; Manufacturer Part Number: CC0402_10NF_16V_10%_X7R; Case: 0402; Mounted: Yes; Socket: No; SMD: Yes; Sense: No; Manufacturer1 Example: PHYCOMP; Manufacturer1 ComponentHeight: 0.55mm; HelpURL: \\cern.ch\dfs\Applications\Altium\Datasheets\CC0402_X7R_PHYCOMP.pdf; Author: CERN DEM JLC; CreateDate: 03.12.2007; LatestRevisionDate: 03.12.2007
C267-C269 C272 = CC0402_10NF_50V_10%_X7R: Non-polarised capacitor; Part Description: SMD Multilayer Chip Ceramic Capacitor; Manufacturer: GENERIC; Manufacturer1 Part Number: GRM155R71H103KA88D; Voltage: 50V; TC: X7R; Tolerance: ±10%; Part Number: CC0402_10NF_50V_10%_X7R; Component Kind: Standard; Component Type: Standard; Pin Count: 2; Value: 10nF; Status: None; Manufacturer Part Number: CC0402_10NF_50V_10%_X7R; Case: 0402; Mounted: Yes; Socket: No; SMD: Yes; Sense: No; Manufacturer1 Example: MURATA; Manufacturer1 ComponentHeight: 0.55mm; HelpURL: \\cern.ch\dfs\Applications\Altium\Datasheets\CC0402_X7R_MURATA_GRM.pdf; Author: CERN DEM MR; CreateDate: 08/01/2016; LatestRevisionDate: 08/01/2016
C270 C271 = CC0402_100NF_25V_10%_X7R_YUDEN_TMK105B7104KVHF: Non-polarised capacitor; Part Description: SMD Multilayer Chip Ceramic Capacitor (High Dielectric Type) for Automotive / Industrial Applications; Manufacturer: TAIYO YUDEN; Voltage: 25V; TC: X7R; Tolerance: ±10%; Part Number: CC0402_100NF_25V_10%_X7R_YUDEN_TMK105B7104KVHF; Component Kind: Standard; Component Type: Standard; Pin Count: 2; Value: 100nF; Status: Not Recommended; Manufacturer Part Number: TMK105B7104KVHF; Case: 0402; Mounted: Yes; Socket: No; SMD: Yes; Sense: No; HelpURL: \\cern.ch\dfs\Applications\Altium\Datasheets\CC0402_TAIYO-YUDEN_TMK105B7104KVHF.pdf; Author: CERN DEM JLC; CreateDate: 10/05/2017; LatestRevisionDate: 10/05/2017; ComponentHeight: 0.55mm
C281-C286 = CC0805_22UF_16V_10%_X5R: Non-polarised capacitor; Part Description: SMD Multilayer Chip Ceramic Capacitor; Manufacturer: GENERIC; Manufacturer1 Part Number: C2012X5R1C226KT; Voltage: 16V; TC: X5R; Tolerance: ±10%; Part Number: CC0805_22UF_16V_10%_X5R; Component Kind: Standard; Component Type: Standard; Pin Count: 2; Value: 22uF; Status: Preferred; Manufacturer Part Number: CC0805_22UF_16V_10%_X5R; Case: 0805; Mounted: Yes; Socket: No; SMD: Yes; Sense: No; Manufacturer1 Example: TDK; Manufacturer1 ComponentHeight: 1.35mm; HelpURL: \\cern.ch\dfs\Applications\Altium\Datasheets\CC0805_X5R_TDK_C.pdf; Author: CERN DEM JLC; CreateDate: 25.10.2012; LatestRevisionDate: 25.10.2012
D18 D19 = BAT165: Schottky Diode; Part Description: Medium Power AF Schottky Diode; Manufacturer: INFINEON; Voltage: 40V; Power: 750mA; PressFit: No; Bonding: No; Part Number: BAT165; Component Kind: Standard; Component Type: Standard; Device: BAT165; PackageDescription: Small Outline Diode Flat Lead (SOD-323), 1.70mm W X 1.25mm L X 1.10mm H body,  IPC Medium Density; Manufacturer Part Number: BAT165; Pin Count: 2; Case: SOD323; Mounted: Yes; Socket: No; SMD: Yes; Sense: No; ComponentHeight: 1.1mm; HelpURL: \\cern.ch\dfs\Applications\Altium\Datasheets\BAT165.pdf; Author: CERN DEM JLC; CreateDate: 2014-11-12; LatestRevisionDate: 2014-11-12
IC18 = MAX4372FEUK: High side current sense amplifier (x50); Manufacturer: Maxim; Bonding: No; PressFit: No; Case: SOT23-5; Component Kind: Standard; Component Type: Standard; ComponentHeigth: *; CreateDate: 2018-01-01; Device: MAX4372FEUK; Footprint: SOT23-5; HelpURL: *; LatestRevisionDate: 2018-01-01; Manufacturer Part Number: MAX4372FEUK; Mounted: Yes; PackageDescription: SOT23-5; Part Description: High side current sense amplifier (x50); Part Number: MAX4372FEUK; Pin Count: 5; Sense: No; SMD: Yes; Socket: No; Value: *
IC22 IC23#1 = MPM3840: 2A, 5.5V, 1.2MHZ SIMPLE MODULE regulator; Manufacturer: MPS; Manufacturer P/N: MPM3820GQV-P; Package: QFN-20(3mm*5mm); Value: MPM3820
L2 L3 = IND2020_1UH_20%_VISHAY_IHLP-2020CZ-11: Inductor With Core; Part Description: Low Profile, High Current IHLP® Inductor; Manufacturer: VISHAY DALE; Manufacturer Part Number: IHLP2020CZER1R0M11; Power: 10A; Resistance: 0.011R; Tolerance: ±20%; Part Number: IND2020_1UH_20%_VISHAY_IHLP-2020CZ-11; Component Kind: Standard; Component Type: Standard; Pin Count: 2; Value: 1uH; Status: None; Case: 2020; Mounted: Yes; Socket: No; SMD: Yes; Sense: No; ComponentHeight: 3mm; HelpURL: \\cern.ch\dfs\Applications\Altium\Datasheets\IND2020_VISHAY_IHLP2020CZ-11.pdf; Author: CERN DEM BC; CreateDate: 24.09.2019; LatestRevisionDate: 24.09.2019
R175 R182 R183 R190 = R0402_0R_JUMPER: Resistor; Part Description: 1A (0.05R Max DC Resistance) Zero Ohm Jumper; Manufacturer: GENERIC; Manufacturer1 Part Number: 232270591001L; PressFit: No; Part Number: R0402_0R_JUMPER; Component Kind: Standard; Component Type: Standard; Pin Count: 2; Value: 0; Status: Not Recommended; Manufacturer Part Number: R0402_0R_JUMPER; Case: 0402; Mounted: Yes; Sense: No; Socket: No; SMD: Yes; Manufacturer1 Example: YAGEO PHYCOMP; Manufacturer1 ComponentHeight: 0.4mm; HelpURL: \\cern.ch\dfs\Applications\Altium\Datasheets\R0402_Phycomp_RC0402.pdf; Author: CERN DEM JLC; CreateDate: 03.12.2007; LatestRevisionDate: 17.10.2012
R176 R184 = R0805_10R_1%_0.125W_200PPM: Resistor - 1%; Part Description: General Purpose Thick Film Chip Resistor; Manufacturer: GENERIC; Manufacturer1 Part Number: NRC10F10R0TRF; Power: 0.125W; TC: ±200ppm/°C; PressFit: No; Part Number: R0805_10R_1%_0.125W_200PPM; Component Kind: Standard; Component Type: Standard; Pin Count: 2; Value: 10; Status: Preferred; Tolerance: ±1%; Manufacturer Part Number: R0805_10R_1%_0.125W_200PPM; Case: 0805; Mounted: Yes; Sense: No; Socket: No; SMD: Yes; Manufacturer1 Example: NIC COMPONENT; Manufacturer1 ComponentHeight: 0.6mm; HelpURL: \\cern.ch\dfs\Applications\Altium\Datasheets\R0805_NIC_NRC.pdf; Author: CERN DEM JLC; CreateDate: 03.12.2007; LatestRevisionDate: 24.06.2009
R177 R185 R272 R274 R277 R288 R289 = R0402_10K_1%_0.0625W_100PPM: Resistor - 1%; Part Description: General Purpose Thick Film Chip Resistor; Manufacturer: GENERIC; Manufacturer1 Part Number: 232270671003L; TC: ±100ppm/°C; PressFit: No; Part Number: R0402_10K_1%_0.0625W_100PPM; Component Kind: Standard; Component Type: Standard; Pin Count: 2; Value: 10k; Status: Not Recommended; Power: 0.0625W; Tolerance: ±1%; Manufacturer Part Number: R0402_10K_1%_0.0625W_100PPM; Case: 0402; Mounted: Yes; Sense: No; Socket: No; SMD: Yes; Manufacturer1 Example: YAGEO PHYCOMP; Manufacturer1 ComponentHeight: 0.4mm; HelpURL: \\cern.ch\dfs\Applications\Altium\Datasheets\R0402_Phycomp_RC0402.pdf; Author: CERN DEM JLC
  R177 R185 R274: CreateDate: 03.12.2007; LatestRevisionDate: 17.10.2012
  R272 R277 R288 R289: CreateDate: 03/12/2007; LatestRevisionDate: 17/10/2012
R178 R180 R186 = R0603_1K_0.1%_0.063W_10PPM: Resistor - 0.1%; Part Description: Thin Film Chip Resistor; Manufacturer: GENERIC; Manufacturer1 Part Number: RN73C1J1K0BTG; Power: 0.063W; TC: ±10ppm; PressFit: No; Part Number: R0603_1K_0.1%_0.063W_10PPM; Component Kind: Standard; Component Type: Standard; Pin Count: 2; Value: 1k; Status: Not Recommended; Tolerance: ±0.1%; Manufacturer Part Number: R0603_1K_0.1%_0.063W_10PPM; Case: 0603; Mounted: Yes; Sense: No; Socket: No; SMD: Yes; Manufacturer1 Example: TYCO HOLSWORTHY; Manufacturer1 ComponentHeight: 0.55mm; HelpURL: \\cern.ch\dfs\Applications\Altium\Datasheets\R0603_Tyco_RN73.pdf; Author: CERN DEM BC; CreateDate: 23.05.2016; LatestRevisionDate: 23.05.2016
R179 R181 R187 R189 = R0603_1R_1%_0.1W_200PPM: Resistor - 1%; Part Description: General Purpose Thick Film Chip Resistor; Manufacturer: GENERIC; Manufacturer1 Part Number: 232270461008L or RC0603FR-071RL; Power: 0.1W; TC: ±200ppm/°C; PressFit: No; Part Number: R0603_1R_1%_0.1W_200PPM; Component Kind: Standard; Component Type: Standard; Pin Count: 2; Value: 1; Status: Preferred; Tolerance: ±1%; Manufacturer Part Number: R0603_1R_1%_0.1W_200PPM; Case: 0603; Mounted: Yes; Sense: No; Socket: No; SMD: Yes; Manufacturer1 Example: YAGEO PHYCOMP; Manufacturer1 ComponentHeight: 0.65mm; HelpURL: \\cern.ch\dfs\Applications\Altium\Datasheets\R0603_Phycomp_RC0603.pdf; Author: CERN DEM JLC; CreateDate: 03.12.2007; LatestRevisionDate: 17.10.2012
R188 = R0603_316R_0.1%_0.063W_10PPM: Resistor - 0.1%; Part Description: Thin Film Chip Resistor; Manufacturer: GENERIC; Manufacturer1 Part Number: RN73C1J316RBTDF; Power: 0.063W; TC: ±10ppm; PressFit: No; Part Number: R0603_316R_0.1%_0.063W_10PPM; Component Kind: Standard; Component Type: Standard; Pin Count: 2; Value: 316; Status: Not Recommended; Tolerance: ±0.1%; Manufacturer Part Number: R0603_316R_0.1%_0.063W_10PPM; Case: 0603; Mounted: Yes; Sense: No; Socket: No; SMD: Yes; Manufacturer1 Example: TYCO HOLSWORTHY; Manufacturer1 ComponentHeight: 0.5mm; HelpURL: \\cern.ch\dfs\Applications\Altium\Datasheets\R0603_Tyco_RN73.pdf; Author: CERN DEM JLC; CreateDate: 03.12.2007; LatestRevisionDate: 13.03.2008
R243 R269 R271 R275 R349 R350 = R0402_100K_1%_0.0625W_100PPM: Resistor - 1%; Part Description: General Purpose Thick Film Chip Resistor; Manufacturer: GENERIC; Manufacturer1 Part Number: 232270671004L; TC: ±100ppm/°C; PressFit: No; Part Number: R0402_100K_1%_0.0625W_100PPM; Component Kind: Standard; Component Type: Standard; Pin Count: 2; Value: 100k; Status: Not Recommended; Power: 0.0625W; Tolerance: ±1%; Manufacturer Part Number: R0402_100K_1%_0.0625W_100PPM; Case: 0402; Mounted: Yes; Sense: No; Socket: No; SMD: Yes; Manufacturer1 Example: YAGEO PHYCOMP; Manufacturer1 ComponentHeight: 0.4mm; HelpURL: \\cern.ch\dfs\Applications\Altium\Datasheets\R0402_Phycomp_RC0402.pdf; Author: CERN DEM JLC
  R243 R271 R275 R349 R350: CreateDate: 03.12.2007; LatestRevisionDate: 17.10.2012
  R269: CreateDate: 03/12/2007; LatestRevisionDate: 17/10/2012
R244 = R0402_36K_1%_0.0625W_100PPM: Resistor - 1%; Part Description: General Purpose Thick Film Chip Resistor; Manufacturer: GENERIC; Manufacturer1 Part Number: 232270673603L; TC: ±100ppm/°C; PressFit: No; Part Number: R0402_36K_1%_0.0625W_100PPM; Component Kind: Standard; Component Type: Standard; Pin Count: 2; Value: 36k; Status: Not Recommended; Power: 0.0625W; Tolerance: ±1%; Manufacturer Part Number: R0402_36K_1%_0.0625W_100PPM; Case: 0402; Mounted: Yes; Sense: No; Socket: No; SMD: Yes; Manufacturer1 Example: YAGEO PHYCOMP; Manufacturer1 ComponentHeight: 0.4mm; HelpURL: \\cern.ch\dfs\Applications\Altium\Datasheets\R0402_Phycomp_RC0402.pdf; Author: CERN DEM JLC; CreateDate: 03.12.2007; LatestRevisionDate: 17.10.2012
R270 R276 = R0402_18K_1%_0.0625W_100PPM: Resistor - 1%; Part Description: General Purpose Thick Film Chip Resistor; Manufacturer: GENERIC; Manufacturer1 Part Number: 232270671803L; TC: ±100ppm/°C; PressFit: No; Part Number: R0402_18K_1%_0.0625W_100PPM; Component Kind: Standard; Component Type: Standard; Pin Count: 2; Value: 18k; Status: Not Recommended; Power: 0.0625W; Tolerance: ±1%; Manufacturer Part Number: R0402_18K_1%_0.0625W_100PPM; Case: 0402; Mounted: Yes; Sense: No; Socket: No; SMD: Yes; Manufacturer1 Example: YAGEO PHYCOMP; Manufacturer1 ComponentHeight: 0.4mm; HelpURL: \\cern.ch\dfs\Applications\Altium\Datasheets\R0402_Phycomp_RC0402.pdf; Author: CERN DEM JLC
  R270: CreateDate: 03/12/2007; LatestRevisionDate: 17/10/2012
  R276: CreateDate: 03.12.2007; LatestRevisionDate: 17.10.2012
R273 = R1206_0R22_1%_0.5W_100PPM: Resistor - 1%; Part Description: Thick Film Chip Resistor; Manufacturer: GENERIC; Power: 0.5W; TC: ±100ppm/°C; PressFit: No; Part Number: R1206_0R22_1%_0.5W_100PPM; Component Kind: Standard; Component Type: Standard; Pin Count: 2; Value: 0R22; Status: Not Recommended; Tolerance: ±1%; Manufacturer Part Number: R1206_0R22_1%_0.5W_100PPM; Case: 1206; Mounted: Yes; Sense: No; Socket: No; SMD: Yes; Manufacturer1 Example: VISHAY DALE; Manufacturer1 ComponentHeight: 0.7mm; HelpURL: \\cern.ch\dfs\Applications\Altium\Datasheets\R1206_VISHAY_RCWE.pdf; Author: CERN DEM JLC; CreateDate: 16.08.2012; LatestRevisionDate: 16.08.2012
R278 = R0402_24K_1%_0.0625W_100PPM: Resistor - 1%; Part Description: General Purpose Thick Film Chip Resistor; Manufacturer: GENERIC; Manufacturer1 Part Number: 232270672403L; TC: ±100ppm/°C; PressFit: No; Part Number: R0402_24K_1%_0.0625W_100PPM; Component Kind: Standard; Component Type: Standard; Pin Count: 2; Value: 24k; Status: Not Recommended; Power: 0.0625W; Tolerance: ±1%; Manufacturer Part Number: R0402_24K_1%_0.0625W_100PPM; Case: 0402; Mounted: Yes; Sense: No; Socket: No; SMD: Yes; Manufacturer1 Example: YAGEO PHYCOMP; Manufacturer1 ComponentHeight: 0.4mm; HelpURL: \\cern.ch\dfs\Applications\Altium\Datasheets\R0402_Phycomp_RC0402.pdf; Author: CERN DEM JLC; CreateDate: 03/12/2007; LatestRevisionDate: 17/10/2012
R279 = R0402_75K_1%_0.0625W_100PPM: Resistor - 1%; Part Description: General Purpose Thick Film Chip Resistor; Manufacturer: GENERIC; Manufacturer1 Part Number: 232270677503L; TC: ±100ppm/°C; PressFit: No; Part Number: R0402_75K_1%_0.0625W_100PPM; Component Kind: Standard; Component Type: Standard; Pin Count: 2; Value: 75k; Status: Not Recommended; Power: 0.0625W; Tolerance: ±1%; Manufacturer Part Number: R0402_75K_1%_0.0625W_100PPM; Case: 0402; Mounted: Yes; Sense: No; Socket: No; SMD: Yes; Manufacturer1 Example: YAGEO PHYCOMP; Manufacturer1 ComponentHeight: 0.4mm; HelpURL: \\cern.ch\dfs\Applications\Altium\Datasheets\R0402_Phycomp_RC0402.pdf; Author: CERN DEM JLC; CreateDate: 03/12/2007; LatestRevisionDate: 17/10/2012
R348 = R0402_200K_1%_0.0625W_100PPM: Resistor - 1%; Part Description: General Purpose Thick Film Chip Resistor; Manufacturer: GENERIC; Manufacturer1 Part Number: 232270672004L; TC: ±100ppm/°C; PressFit: No; Part Number: R0402_200K_1%_0.0625W_100PPM; Component Kind: Standard; Component Type: Standard; Pin Count: 2; Value: 200k; Status: Not Recommended; Power: 0.0625W; Tolerance: ±1%; Manufacturer Part Number: R0402_200K_1%_0.0625W_100PPM; Case: 0402; Mounted: Yes; Sense: No; Socket: No; SMD: Yes; Manufacturer1 Example: YAGEO PHYCOMP; Manufacturer1 ComponentHeight: 0.4mm; HelpURL: \\cern.ch\dfs\Applications\Altium\Datasheets\R0402_Phycomp_RC0402.pdf; Author: CERN DEM JLC; CreateDate: 03.12.2007; LatestRevisionDate: 17.10.2012
R351 = R0603_63K4_0.1%_0.063W_10PPM: Resistor - 0.1%; Part Description: Thin Film Chip Resistor; Manufacturer: GENERIC; Manufacturer1 Part Number: RN73C1J63K4BTDF; Power: 0.063W; TC: ±10ppm; PressFit: No; Part Number: R0603_63K4_0.1%_0.063W_10PPM; Component Kind: Standard; Component Type: Standard; Pin Count: 2; Value: 63k4; Status: Not Recommended; Tolerance: ±0.1%; Manufacturer Part Number: R0603_63K4_0.1%_0.063W_10PPM; Case: 0603; Mounted: Yes; Sense: No; Socket: No; SMD: Yes; Manufacturer1 Example: TYCO HOLSWORTHY; Manufacturer1 ComponentHeight: 0.5mm; HelpURL: \\cern.ch\dfs\Applications\Altium\Datasheets\R0603_Tyco_RN73.pdf; Author: CERN DEM JLC; CreateDate: 03.12.2007; LatestRevisionDate: 13.03.2008
T5 = 2N7002BKS: 60V, 300mA Dual N-Channel Trench MOSFET; Manufacturer: NXP SEMICONDUCTORS; Manufacturer Part Number: 2N7002BKS6; PressFit: No; Bonding: No; Part Number: 2N7002BKS; Component Kind: Standard; Component Type: Standard; Device: 2N7002BKS; PackageDescription: SOT363, SC70-6, SOT, 0.65mm Pitch, 6 pin, 1.25mm W X 2.00mm L X 1.10mm H, IPC Medium Density; Part Description: 60 V, 300 mA Dual N-Channel Trench MOSFET; Pin Count: 4; Case: SOT363; Mounted: Yes; Socket: No; SMD: Yes; Sense: No; ComponentHeight: 1.1mm; HelpURL: \\cern.ch\dfs\Applications\Altium\Datasheets\2N7002BKS.pdf; Author: CERN DEM JLC; CreateDate: 2012-11-27; LatestRevisionDate: 2012-11-27
TP11 TP12 TP14 TP23 = SMD_PAD_1.27X1.27MM: Part Description: 1.27mm x 1.27mm PCB Copper Area (SMD Test Point); Mounted: No; Part Number: SMD_PAD_1.27X1.27MM; Component Kind: Standard (No BOM); Component Type: Standard (No BOM); Pin Count: 1; Family: Test Point; Socket: No; Sense: No; Status: None; ComponentHeight: 0mm; HelpURL: Undefined; Author: CERN DEM JLC; CreateDate: 12.01.2008; LatestRevisionDate: 12.01.2008; PackageDescription: 1.27mm x 1.27mm PCB Copper Area (SMD Test Point)
  TP11 TP12 TP23: SMD: No
  TP14: SMD: Yes
U9 U10 = ISL71001M: CDS_PHYS_PART_NAME: ISL71001M_TQFP-EP1-ISL71001MNZB; OriginalSymbolOrigin: (-950,950); PACK_TYPE: TQFP-EP1; FILE_PATH: ./MODELS; FILE_NAME: ISL70002SEH; XY: (-900,500); VER: 1; ROT: 0; LOCATION: U1; DRAWING: @ISL71001M_LIB.ISL71001MEVAL1ZA(SCH_1):PAGE1; CDS_LIB: regulators; PART_NAME: ISL71001M; SEC_TYPE: TQFP-EP1; PHYS_PAGE: 1; CHIPS_PART_NAME: ISL71001M; CDS_PART_NAME: ISL71001M_TQFP-EP1-ISL71001MNZB; CDS_LOCATION: U1